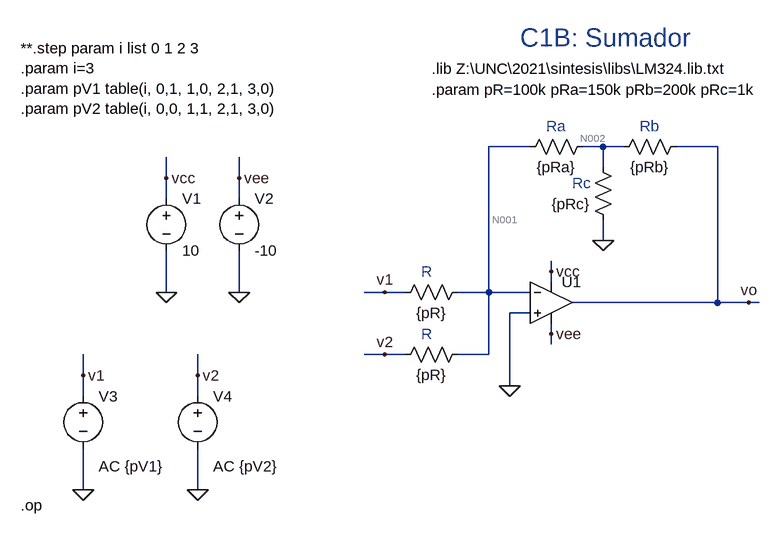
[diagram p0: schematic c1BSumador.asc]
c1BSumador.asc, the LTspice schematic file:
Version 4
SHEET 1 1432 680
WIRE -32 -32 -96 -32
WIRE 80 -32 48 -32
WIRE 112 -32 80 -32
WIRE 256 -32 192 -32
WIRE 80 0 80 -32
WIRE -592 16 -592 -16
WIRE -480 16 -480 -16
WIRE -592 48 -592 16
WIRE -480 48 -480 16
WIRE 80 112 80 80
WIRE 0 160 0 144
WIRE 0 176 0 160
WIRE -592 192 -592 128
WIRE -480 192 -480 128
WIRE -256 192 -288 192
WIRE -224 192 -256 192
WIRE -96 192 -96 -32
WIRE -96 192 -144 192
WIRE -32 192 -96 192
WIRE 256 208 256 -32
WIRE 256 208 32 208
WIRE 304 208 256 208
WIRE 320 208 304 208
WIRE -32 224 -64 224
WIRE 0 256 0 240
WIRE 0 272 0 256
WIRE -256 288 -288 288
WIRE -224 288 -256 288
WIRE -96 288 -96 192
WIRE -96 288 -144 288
WIRE -720 320 -720 288
WIRE -544 320 -544 288
WIRE -64 336 -64 224
WIRE -720 352 -720 320
WIRE -544 352 -544 320
WIRE -720 496 -720 432
WIRE -544 496 -544 432
FLAG -64 336 0
FLAG 0 160 vcc
FLAG 0 256 vee
FLAG -256 192 v1
FLAG -256 288 v2
FLAG -592 192 0
FLAG -592 16 vcc
FLAG -480 192 0
FLAG -480 16 vee
FLAG -720 496 0
FLAG -720 320 v1
FLAG -544 496 0
FLAG -544 320 v2
FLAG 80 112 0
FLAG 304 208 vo
DATAFLAG 256 208 ""
SYMBOL res -128 176 R90
WINDOW 0 0 56 Invisible 2
WINDOW 3 32 56 VTop 2
SYMATTR InstName R1
SYMATTR Value {pR}
SYMBOL voltage -592 32 R0
WINDOW 123 0 0 Left 0
WINDOW 39 0 0 Left 0
SYMATTR InstName V1
SYMATTR Value 10
SYMBOL voltage -480 32 R0
WINDOW 123 0 0 Left 0
WINDOW 39 0 0 Left 0
SYMATTR InstName V2
SYMATTR Value -10
SYMBOL voltage -720 336 R0
WINDOW 123 24 124 Left 2
WINDOW 39 24 44 Left 2
SYMATTR Value2 AC {pV1}
SYMATTR InstName V3
SYMATTR Value ""
SYMBOL voltage -544 336 R0
WINDOW 123 24 124 Left 2
WINDOW 39 0 0 Left 0
SYMATTR Value2 AC {pV2}
SYMATTR InstName V4
SYMATTR Value ""
SYMBOL res -128 272 R90
WINDOW 0 0 56 Invisible 2
WINDOW 3 32 56 VTop 2
SYMATTR InstName R2
SYMATTR Value {pR}
SYMBOL res 64 -48 R90
WINDOW 0 0 56 Invisible 2
WINDOW 3 32 56 VTop 2
SYMATTR InstName R3
SYMATTR Value {pRa}
SYMBOL res 96 96 R180
WINDOW 0 36 76 Invisible 2
WINDOW 3 36 40 Left 2
SYMATTR InstName R4
SYMATTR Value {pRc}
SYMBOL res 96 -16 R270
WINDOW 0 32 56 Invisible 2
WINDOW 3 0 56 VBottom 2
SYMATTR InstName R5
SYMATTR Value {pRb}
SYMBOL OpAmps\\UniversalOpamp2 0 208 R0
SYMATTR InstName U1
SYMATTR Value2 Avol=1T GBW=1T Slew=.5Meg
SYMATTR SpiceLine ilimit=25m rail=0 Vos=2m phimargin=45
SYMATTR SpiceLine2 en=0 enk=0 in=0 ink=0 Rin=500T
TEXT -184 -120 Left 2 !.param pR=100k pRa=150k pRb=200k pRc=1k
TEXT -184 -152 Left 2 !.lib Z:\\UNC\\2021\\sintesis\\libs\\LM324.lib.txt
TEXT -816 -184 Left 2 !**.step param i list 0 1 2 3\n.param i=3\n.param pV1 table(i, 0,1, 1,0, 2,1, 3,0)\n.param pV2 table(i, 0,0, 1,1, 2,1, 3,0)
TEXT -48 -200 Left 4 ;C1B: Sumador
TEXT -200 256 Left 2 ;R
TEXT -200 160 Left 2 ;R
TEXT -8 -64 Left 2 ;Ra
TEXT 136 -64 Left 2 ;Rb
TEXT 32 24 Left 2 ;Rc
TEXT -816 520 Left 2 !.op

The netlist it stands for:
* c1BSumador.asc
R1 N001 v1 {pR}
V1 vcc 0 10
V2 vee 0 -10
V3 v1 0 AC {pV1}
V4 v2 0 AC {pV2}
R2 N001 v2 {pR}
R3 N002 N001 {pRa}
R4 0 N002 {pRc}
R5 N002 vo {pRb}
XU1 0 N001 vcc vee vo level.2 Avol=1T GBW=1T Slew=.5Meg ilimit=25m rail=0 Vos=2m phimargin=45 en=0 enk=0 in=0 ink=0 Rin=500T  ; pins IN+ IN- V+ V- OUT
.param pR=100k pRa=150k pRb=200k pRc=1k
.lib Z:\UNC\2021\sintesis\libs\LM324.lib.txt
**.step param i list 0 1 2 3
.param i=3
.param pV1 table(i, 0,1, 1,0, 2,1, 3,0)
.param pV2 table(i, 0,0, 1,1, 2,1, 3,0)
* C1B: Sumador
* R
* R
* Ra
* Rb
* Rc
.op
.lib UniversalOpamps2.sub
.backanno
.end

* Results of the author's LTspice run, read from the files saved beside the schematic
* Operating Point:
*   V(n001) = 2 mV
*   V(v1) = 0 V
*   V(vcc) = 10 V
*   V(vee) = -10 V
*   V(v2) = 0 V
*   V(n002) = 8 mV
*   V(vo) = 1.616 V
*   I(R5) = -8.04 µA
*   I(R4) = -8 µA
*   I(R3) = 40 nA
*   I(R2) = 20 nA
*   I(R1) = 20 nA
*   I(V4) = 20 nA
*   I(V3) = 20 nA
*   I(V2) = 10 µA
*   I(V1) = -10 µA
*   Ix(u1:1) = 0 A
*   Ix(u1:2) = 0 A
*   Ix(u1:3) = 10 µA
*   Ix(u1:4) = -10 µA
*   Ix(u1:5) = -8.04 µA
* From the log:
*   Semiconductor Device Operating Points:
*                           --- Diodes ---
*   Name:    d:u1:oi
*   Model:   u1:lim
*   Id:      8.04e-06
*   Vd:      8.04e-09
*   Req:     1.00e+03
*   CAP:     0.00e+00